# Altium project SoM.PrjPcb (part 4 of 4)
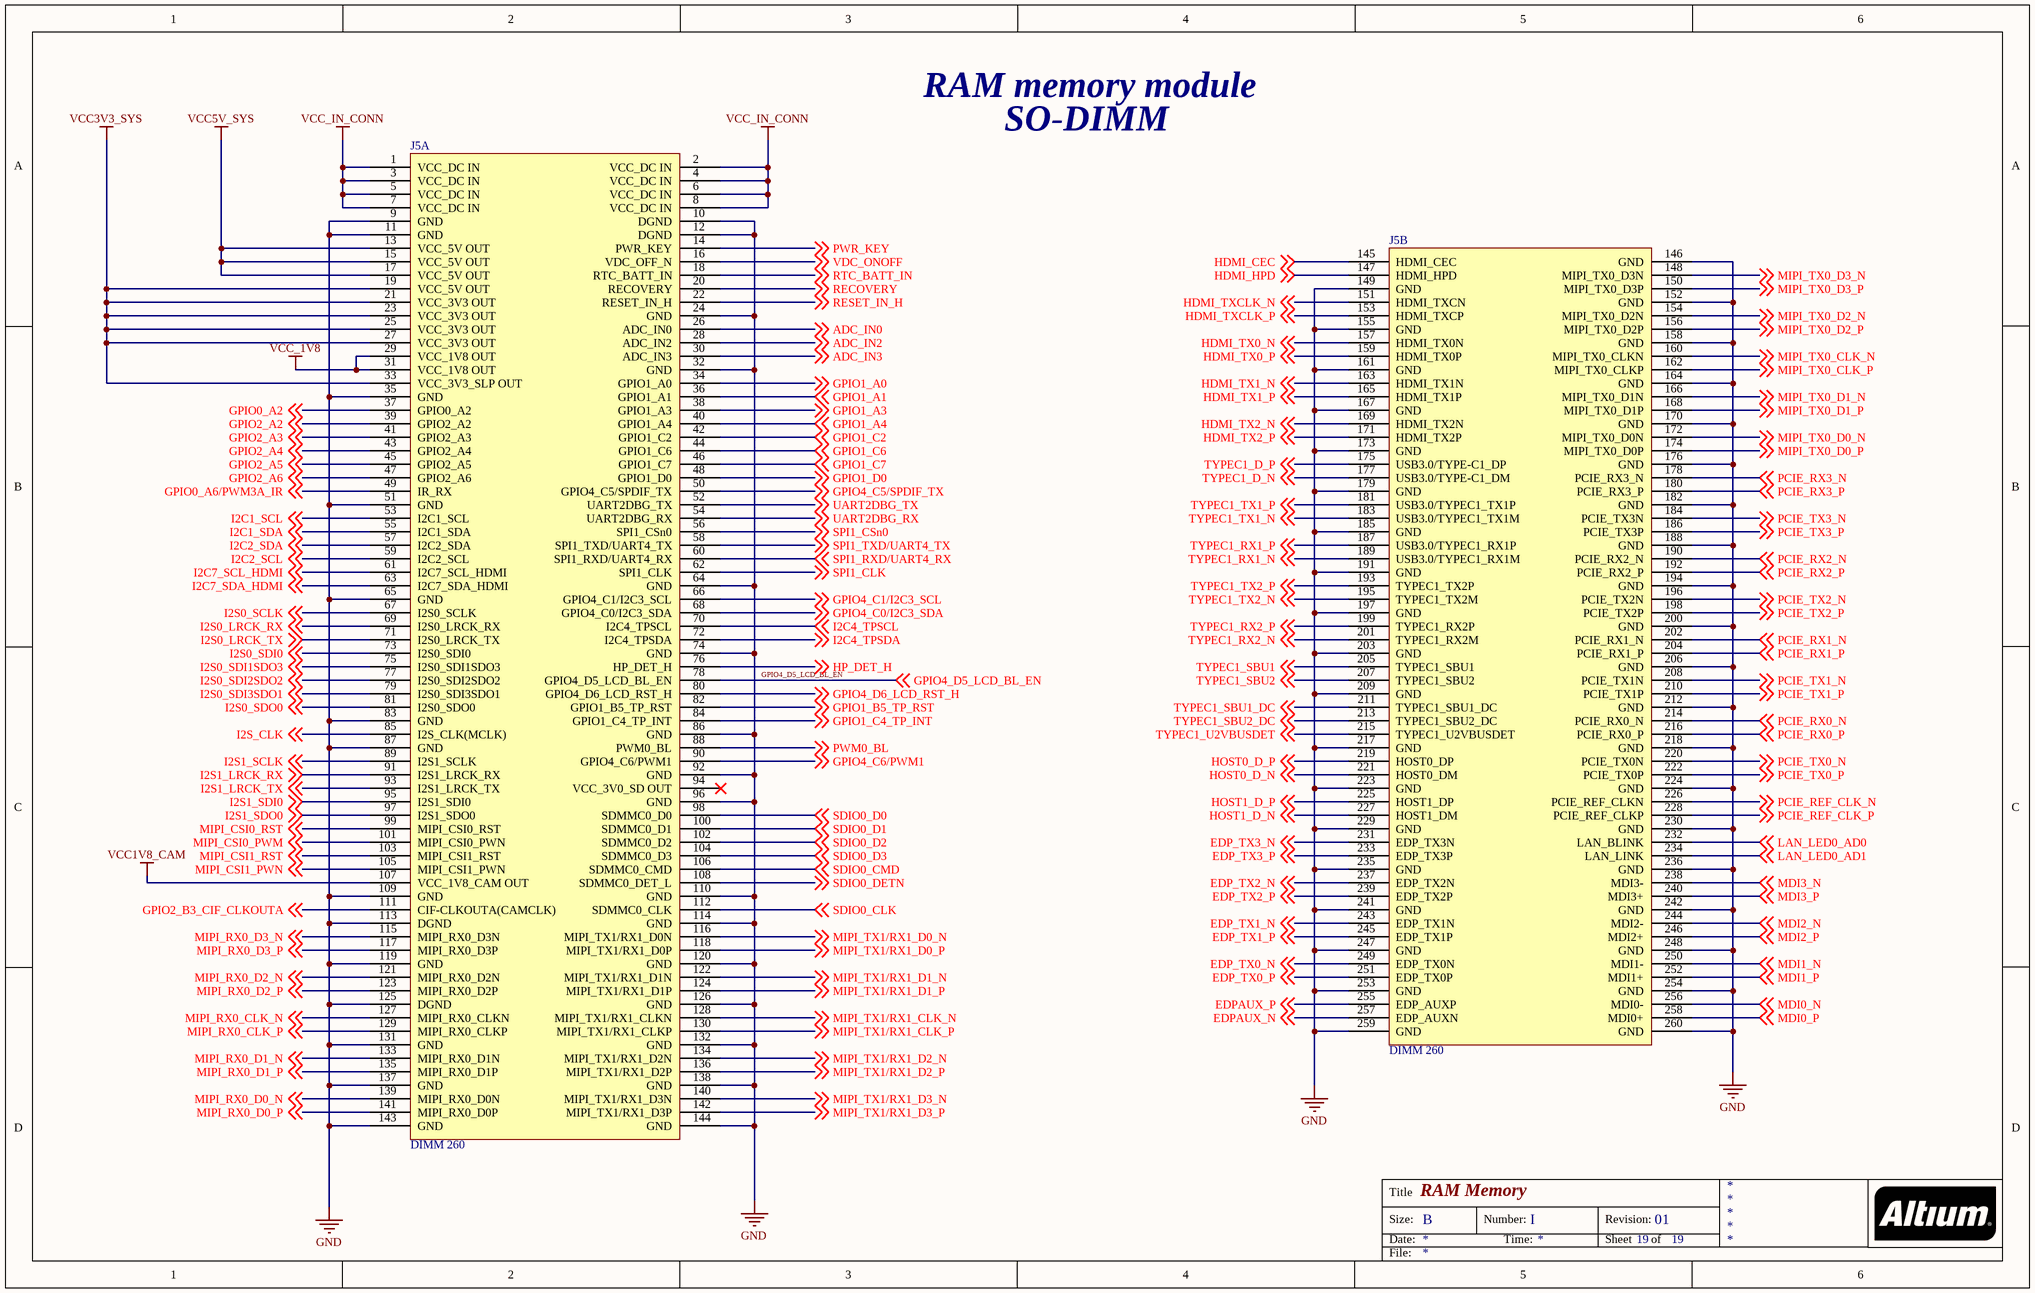
[diagram p19: [19] RAM Memory module.SchDoc]

## Nets that join several sheets
EDP_AVDD_0V9: [2] RK3399_SDRAM (FB3.2 FB5.2), [3] RK3399_PMU (FB8.1 U8.T24), [4] RK3399_EMMC_ADC_PCIE (C187.2 C192.2 U8.L24 U8.W24), [5] RK3399_EDP_CSI_HDMI (6 pins), [6] RK3399_USB2_USIC (8 pins), [17] Voltage_Regulators (C305.2 L7.2 R112.2)
EDP_AVDD_1V8: [11] FlashMemory (9 pins), [3] RK3399_PMU (FB7.2 FB9.1), [4] RK3399_EMMC_ADC_PCIE (5 pins), [5] RK3399_EDP_CSI_HDMI (8 pins), [6] RK3399_USB2_USIC (6 pins), [7] RK3399_MIPI-CSI_I2C (12 pins), [8] RK3399_SDIO_SPI_GPIOs (C225.2 C227.2 U8.AB8 U8.J22), [17] Voltage_Regulators (R105.2 R106.2 R109.1), [18] Power_Management (5 pins), [19] RAM Memory module (J5.29 J5.31)
GND: [9] LPDDR4_SDRAM1 (104 pins), [10] LPDDR_SDRAM2 (104 pins), [11] FlashMemory (19 pins), [12] WIFI_Module (29 pins), [1] RK3399_PowerPins (273 pins), [2] RK3399_SDRAM (20 pins), [3] RK3399_PMU (14 pins), [4] RK3399_EMMC_ADC_PCIE (9 pins), [5] RK3399_EDP_CSI_HDMI (18 pins), [6] RK3399_USB2_USIC (17 pins), [7] RK3399_MIPI-CSI_I2C (6 pins), [8] RK3399_SDIO_SPI_GPIOs (10 pins), [13] TYPEC0_PROG (23 pins), [14] Ethernet (29 pins), [15] PushButtons (Q1.2 SW2.1 SW3.1), [16] SPI_TYPEC_PWR (34 pins), [17] Voltage_Regulators (45 pins), [18] Power_Management (57 pins), [19] RAM Memory module (69 pins)
VCC3V3_S5: [16] SPI_TYPEC_PWR (C281.2 C282.2 C283.2 U14.5), [18] Power_Management (5 pins)
VCC5V_SYS: [12] WIFI_Module (C96.1 U4.1 U4.6), [13] TYPEC0_PROG (5 pins), [15] PushButtons (R92.2), [16] SPI_TYPEC_PWR (8 pins), [19] RAM Memory module (J5.13 J5.15 J5.17)
VCC7: [12] WIFI_Module (5 pins), [3] RK3399_PMU (C185.2 U9.1), [13] TYPEC0_PROG (C234.2 U10.4), [15] PushButtons (SW1.1), [16] SPI_TYPEC_PWR (5 pins), [17] Voltage_Regulators (21 pins), [18] Power_Management (30 pins), [19] RAM Memory module (6 pins)
VCC_DDR: [9] LPDDR4_SDRAM1 (43 pins), [10] LPDDR_SDRAM2 (43 pins), [2] RK3399_SDRAM (44 pins), [18] Power_Management (5 pins)
VCC_DDRC: [9] LPDDR4_SDRAM1 (41 pins), [10] LPDDR_SDRAM2 (41 pins), [18] Power_Management (C347.2 Q5.2)
VCC_IN_CONN: [16] SPI_TYPEC_PWR (10 pins), [18] Power_Management (R129.2), [19] RAM Memory module (8 pins)
VLDO1: [18] Power_Management (C313.2 U19.31), [19] RAM Memory module (J5.107)
VLDO4: [4] RK3399_EMMC_ADC_PCIE (C190.2 U8.T23), [18] Power_Management (C324.2 U19.12)
VLDO6: [8] RK3399_SDIO_SPI_GPIOs (C223.2 C230.2 U8.AC8 U8.N23), [18] Power_Management (C326.2 U19.2)
VLDO7: [8] RK3399_SDIO_SPI_GPIOs (5 pins), [18] Power_Management (C316.2 U19.5)
VLDO8: [8] RK3399_SDIO_SPI_GPIOs (8 pins), [17] Voltage_Regulators (R119.1), [18] Power_Management (C327.2 U19.15)
VSOUT1: [11] FlashMemory (7 pins), [6] RK3399_USB2_USIC (6 pins), [8] RK3399_SDIO_SPI_GPIOs (C226.2 U8.J23), [18] Power_Management (C337.2 U19.7)
ADC_IN0: [4] RK3399_EMMC_ADC_PCIE (U8.AG26), [19] RAM Memory module (J5.26)
ADC_IN2: [4] RK3399_EMMC_ADC_PCIE (U8.AG25), [19] RAM Memory module (J5.28)
ADC_IN3: [4] RK3399_EMMC_ADC_PCIE (U8.AG28), [19] RAM Memory module (J5.30)
CPU_B_SLEEP: [8] RK3399_SDIO_SPI_GPIOs (U8.M27), [17] Voltage_Regulators (U16.A1)
DDR0_A0: [9] LPDDR4_SDRAM1 (U1.H2 U1.R2), [2] RK3399_SDRAM (U8.F2)
DDR0_A1: [9] LPDDR4_SDRAM1 (U1.J2 U1.P2), [2] RK3399_SDRAM (U8.F1)
DDR0_A2: [9] LPDDR4_SDRAM1 (U1.H9 U1.R9), [2] RK3399_SDRAM (U8.G1)
DDR0_A3: [9] LPDDR4_SDRAM1 (U1.H10 U1.R10), [2] RK3399_SDRAM (U8.G2)
DDR0_A4: [9] LPDDR4_SDRAM1 (U1.H11 U1.R11), [2] RK3399_SDRAM (U8.H2)
DDR0_A5: [9] LPDDR4_SDRAM1 (U1.J11 U1.P11), [2] RK3399_SDRAM (U8.H1)
DDR0_CKE0: [9] LPDDR4_SDRAM1 (U1.J4 U1.P4), [2] RK3399_SDRAM (U8.E1)
DDR0_CKE1: [9] LPDDR4_SDRAM1 (U1.J5 U1.P5), [2] RK3399_SDRAM (U8.F5)
DDR0_CLK1_N: [9] LPDDR4_SDRAM1 (U1.P9), [2] RK3399_SDRAM (U8.J5)
DDR0_CLK1_P: [9] LPDDR4_SDRAM1 (U1.P8), [2] RK3399_SDRAM (U8.H5)
DDR0_CLK_N: [9] LPDDR4_SDRAM1 (U1.J9), [2] RK3399_SDRAM (U8.J4)
DDR0_CLK_P: [9] LPDDR4_SDRAM1 (U1.J8), [2] RK3399_SDRAM (U8.H4)
DDR0_CS0N: [9] LPDDR4_SDRAM1 (U1.H4), [2] RK3399_SDRAM (U8.M6)
DDR0_CS1N: [9] LPDDR4_SDRAM1 (U1.H3), [2] RK3399_SDRAM (U8.B1)
DDR0_CS2N: [9] LPDDR4_SDRAM1 (U1.R4), [2] RK3399_SDRAM (U8.M5)
DDR0_CS3N: [9] LPDDR4_SDRAM1 (U1.R3), [2] RK3399_SDRAM (U8.C2)
DDR0_D0: [9] LPDDR4_SDRAM1 (U1.B2), [2] RK3399_SDRAM (U8.AB2)
DDR0_D1: [9] LPDDR4_SDRAM1 (U1.C2), [2] RK3399_SDRAM (U8.AB1)
DDR0_D2: [9] LPDDR4_SDRAM1 (U1.E2), [2] RK3399_SDRAM (U8.AA2)
DDR0_D3: [9] LPDDR4_SDRAM1 (U1.F2), [2] RK3399_SDRAM (U8.AA1)
DDR0_D4: [9] LPDDR4_SDRAM1 (U1.F4), [2] RK3399_SDRAM (U8.Y2)
DDR0_D5: [9] LPDDR4_SDRAM1 (U1.E4), [2] RK3399_SDRAM (U8.Y1)
DDR0_D6: [9] LPDDR4_SDRAM1 (U1.C4), [2] RK3399_SDRAM (U8.W1)
DDR0_D7: [9] LPDDR4_SDRAM1 (U1.B4), [2] RK3399_SDRAM (U8.W2)
DDR0_D8: [9] LPDDR4_SDRAM1 (U1.B11), [2] RK3399_SDRAM (U8.AF2)
DDR0_D9: [9] LPDDR4_SDRAM1 (U1.C11), [2] RK3399_SDRAM (U8.AE2)
DDR0_D10: [9] LPDDR4_SDRAM1 (U1.E11), [2] RK3399_SDRAM (U8.AF1)
DDR0_D11: [9] LPDDR4_SDRAM1 (U1.F11), [2] RK3399_SDRAM (U8.AD2)
DDR0_D12: [9] LPDDR4_SDRAM1 (U1.F9), [2] RK3399_SDRAM (U8.AE1)
DDR0_D13: [9] LPDDR4_SDRAM1 (U1.E9), [2] RK3399_SDRAM (U8.AD1)
DDR0_D14: [9] LPDDR4_SDRAM1 (U1.C9), [2] RK3399_SDRAM (U8.AC1)
DDR0_D15: [9] LPDDR4_SDRAM1 (U1.B9), [2] RK3399_SDRAM (U8.AC2)
DDR0_D16: [9] LPDDR4_SDRAM1 (U1.AA2), [2] RK3399_SDRAM (U8.V1)
DDR0_D17: [9] LPDDR4_SDRAM1 (U1.Y2), [2] RK3399_SDRAM (U8.V2)
DDR0_D18: [9] LPDDR4_SDRAM1 (U1.V2), [2] RK3399_SDRAM (U8.U1)
DDR0_D19: [9] LPDDR4_SDRAM1 (U1.U2), [2] RK3399_SDRAM (U8.U2)
DDR0_D20: [9] LPDDR4_SDRAM1 (U1.U4), [2] RK3399_SDRAM (U8.T1)
DDR0_D21: [9] LPDDR4_SDRAM1 (U1.V4), [2] RK3399_SDRAM (U8.T2)
DDR0_D22: [9] LPDDR4_SDRAM1 (U1.Y4), [2] RK3399_SDRAM (U8.R2)
DDR0_D23: [9] LPDDR4_SDRAM1 (U1.AA4), [2] RK3399_SDRAM (U8.R1)
DDR0_D24: [9] LPDDR4_SDRAM1 (U1.AA11), [2] RK3399_SDRAM (U8.P1)
DDR0_D25: [9] LPDDR4_SDRAM1 (U1.Y11), [2] RK3399_SDRAM (U8.P2)
DDR0_D26: [9] LPDDR4_SDRAM1 (U1.V11), [2] RK3399_SDRAM (U8.N1)
DDR0_D27: [9] LPDDR4_SDRAM1 (U1.U11), [2] RK3399_SDRAM (U8.M1)
DDR0_D28: [9] LPDDR4_SDRAM1 (U1.U9), [2] RK3399_SDRAM (U8.N2)
DDR0_D29: [9] LPDDR4_SDRAM1 (U1.V9), [2] RK3399_SDRAM (U8.L1)
DDR0_D30: [9] LPDDR4_SDRAM1 (U1.Y9), [2] RK3399_SDRAM (U8.M2)
DDR0_D31: [9] LPDDR4_SDRAM1 (U1.AA9), [2] RK3399_SDRAM (U8.L2)
DDR0_DM0: [9] LPDDR4_SDRAM1 (U1.C3), [2] RK3399_SDRAM (U8.Y5)
DDR0_DM1: [9] LPDDR4_SDRAM1 (U1.C10), [2] RK3399_SDRAM (U8.AC5)
DDR0_DM2: [9] LPDDR4_SDRAM1 (U1.Y3), [2] RK3399_SDRAM (U8.U5)
DDR0_DM3: [9] LPDDR4_SDRAM1 (U1.Y10), [2] RK3399_SDRAM (U8.P5)
DDR0_DQS0_N: [9] LPDDR4_SDRAM1 (U1.E3), [2] RK3399_SDRAM (U8.AA4)
DDR0_DQS0_P: [9] LPDDR4_SDRAM1 (U1.D3), [2] RK3399_SDRAM (U8.Y4)
DDR0_DQS1_N: [9] LPDDR4_SDRAM1 (U1.E10), [2] RK3399_SDRAM (U8.AD4)
DDR0_DQS1_P: [9] LPDDR4_SDRAM1 (U1.D10), [2] RK3399_SDRAM (U8.AC4)
DDR0_DQS2_N: [9] LPDDR4_SDRAM1 (U1.V3), [2] RK3399_SDRAM (U8.V4)
DDR0_DQS2_P: [9] LPDDR4_SDRAM1 (U1.W3), [2] RK3399_SDRAM (U8.U4)
DDR0_DQS3_N: [9] LPDDR4_SDRAM1 (U1.V10), [2] RK3399_SDRAM (U8.R4)
DDR0_DQS3_P: [9] LPDDR4_SDRAM1 (U1.W10), [2] RK3399_SDRAM (U8.P4)
DDR0_RST: [9] LPDDR4_SDRAM1 (U1.T11), [2] RK3399_SDRAM (U8.L7)
DDR1_A0: [10] LPDDR_SDRAM2 (U2.H2 U2.R2), [2] RK3399_SDRAM (U8.B10)
DDR1_A1: [10] LPDDR_SDRAM2 (U2.J2 U2.P2), [2] RK3399_SDRAM (U8.A10)
DDR1_A2: [10] LPDDR_SDRAM2 (U2.H9 U2.R9), [2] RK3399_SDRAM (U8.B9)
DDR1_A3: [10] LPDDR_SDRAM2 (U2.H10 U2.R10), [2] RK3399_SDRAM (U8.A9)
DDR1_A4: [10] LPDDR_SDRAM2 (U2.H11 U2.R11), [2] RK3399_SDRAM (U8.B8)
DDR1_A5: [10] LPDDR_SDRAM2 (U2.J11 U2.P11), [2] RK3399_SDRAM (U8.A8)
DDR1_CKE0: [10] LPDDR_SDRAM2 (U2.J4 U2.P4), [2] RK3399_SDRAM (U8.A5)
DDR1_CKE1: [10] LPDDR_SDRAM2 (U2.J5 U2.P5), [2] RK3399_SDRAM (U8.E6)
DDR1_CLK1_N: [10] LPDDR_SDRAM2 (U2.P9), [2] RK3399_SDRAM (U8.E8)
DDR1_CLK1_P: [10] LPDDR_SDRAM2 (U2.P8), [2] RK3399_SDRAM (U8.E9)
DDR1_CLK_N: [10] LPDDR_SDRAM2 (U2.J9), [2] RK3399_SDRAM (U8.D8)
DDR1_CLK_P: [10] LPDDR_SDRAM2 (U2.J8), [2] RK3399_SDRAM (U8.D9)
DDR1_CS0N: [10] LPDDR_SDRAM2 (U2.H4), [2] RK3399_SDRAM (U8.F12)
DDR1_CS1N: [10] LPDDR_SDRAM2 (U2.H3), [2] RK3399_SDRAM (U8.A2)
DDR1_CS2N: [10] LPDDR_SDRAM2 (U2.R4), [2] RK3399_SDRAM (U8.F11)
DDR1_CS3N: [10] LPDDR_SDRAM2 (U2.R3), [2] RK3399_SDRAM (U8.B3)
DDR1_D0: [10] LPDDR_SDRAM2 (U2.B2), [2] RK3399_SDRAM (U8.B15)
DDR1_D1: [10] LPDDR_SDRAM2 (U2.C2), [2] RK3399_SDRAM (U8.A15)
DDR1_D2: [10] LPDDR_SDRAM2 (U2.E2), [2] RK3399_SDRAM (U8.B16)
DDR1_D3: [10] LPDDR_SDRAM2 (U2.F2), [2] RK3399_SDRAM (U8.A16)
DDR1_D4: [10] LPDDR_SDRAM2 (U2.F4), [2] RK3399_SDRAM (U8.B17)
DDR1_D5: [10] LPDDR_SDRAM2 (U2.E4), [2] RK3399_SDRAM (U8.A17)
DDR1_D6: [10] LPDDR_SDRAM2 (U2.C4), [2] RK3399_SDRAM (U8.A18)
DDR1_D7: [10] LPDDR_SDRAM2 (U2.B4), [2] RK3399_SDRAM (U8.B18)
DDR1_D8: [10] LPDDR_SDRAM2 (U2.B11), [2] RK3399_SDRAM (U8.B11)
DDR1_D9: [10] LPDDR_SDRAM2 (U2.C11), [2] RK3399_SDRAM (U8.B12)
DDR1_D10: [10] LPDDR_SDRAM2 (U2.E11), [2] RK3399_SDRAM (U8.A11)
DDR1_D11: [10] LPDDR_SDRAM2 (U2.F11), [2] RK3399_SDRAM (U8.B13)
DDR1_D12: [10] LPDDR_SDRAM2 (U2.F9), [2] RK3399_SDRAM (U8.A12)
DDR1_D13: [10] LPDDR_SDRAM2 (U2.E9), [2] RK3399_SDRAM (U8.A13)
DDR1_D14: [10] LPDDR_SDRAM2 (U2.C9), [2] RK3399_SDRAM (U8.A14)
DDR1_D15: [10] LPDDR_SDRAM2 (U2.B9), [2] RK3399_SDRAM (U8.B14)
DDR1_D16: [10] LPDDR_SDRAM2 (U2.AA2), [2] RK3399_SDRAM (U8.A19)
DDR1_D17: [10] LPDDR_SDRAM2 (U2.Y2), [2] RK3399_SDRAM (U8.B19)
DDR1_D18: [10] LPDDR_SDRAM2 (U2.V2), [2] RK3399_SDRAM (U8.A20)
DDR1_D19: [10] LPDDR_SDRAM2 (U2.U2), [2] RK3399_SDRAM (U8.B20)
DDR1_D20: [10] LPDDR_SDRAM2 (U2.U4), [2] RK3399_SDRAM (U8.A21)
DDR1_D21: [10] LPDDR_SDRAM2 (U2.V4), [2] RK3399_SDRAM (U8.B21)
DDR1_D22: [10] LPDDR_SDRAM2 (U2.Y4), [2] RK3399_SDRAM (U8.B22)
DDR1_D23: [10] LPDDR_SDRAM2 (U2.AA4), [2] RK3399_SDRAM (U8.A22)
DDR1_D24: [10] LPDDR_SDRAM2 (U2.AA11), [2] RK3399_SDRAM (U8.A23)
DDR1_D25: [10] LPDDR_SDRAM2 (U2.Y11), [2] RK3399_SDRAM (U8.B23)
DDR1_D26: [10] LPDDR_SDRAM2 (U2.V11), [2] RK3399_SDRAM (U8.A24)
DDR1_D27: [10] LPDDR_SDRAM2 (U2.U11), [2] RK3399_SDRAM (U8.A25)
DDR1_D28: [10] LPDDR_SDRAM2 (U2.U9), [2] RK3399_SDRAM (U8.B24)
DDR1_D29: [10] LPDDR_SDRAM2 (U2.V9), [2] RK3399_SDRAM (U8.A26)
DDR1_D30: [10] LPDDR_SDRAM2 (U2.Y9), [2] RK3399_SDRAM (U8.B25)
DDR1_D31: [10] LPDDR_SDRAM2 (U2.AA9), [2] RK3399_SDRAM (U8.B26)
DDR1_DM0: [10] LPDDR_SDRAM2 (U2.C3), [2] RK3399_SDRAM (U8.E17)
DDR1_DM1: [10] LPDDR_SDRAM2 (U2.C10), [2] RK3399_SDRAM (U8.E14)
DDR1_DM2: [10] LPDDR_SDRAM2 (U2.Y3), [2] RK3399_SDRAM (U8.E20)
DDR1_DM3: [10] LPDDR_SDRAM2 (U2.Y10), [2] RK3399_SDRAM (U8.E23)
DDR1_DQS0_N: [10] LPDDR_SDRAM2 (U2.E3), [2] RK3399_SDRAM (U8.D17)
DDR1_DQS0_P: [10] LPDDR_SDRAM2 (U2.D3), [2] RK3399_SDRAM (U8.D18)
DDR1_DQS1_N: [10] LPDDR_SDRAM2 (U2.E10), [2] RK3399_SDRAM (U8.D14)
DDR1_DQS1_P: [10] LPDDR_SDRAM2 (U2.D10), [2] RK3399_SDRAM (U8.D15)
DDR1_DQS2_N: [10] LPDDR_SDRAM2 (U2.V3), [2] RK3399_SDRAM (U8.D20)
DDR1_DQS2_P: [10] LPDDR_SDRAM2 (U2.W3), [2] RK3399_SDRAM (U8.D21)
DDR1_DQS3_N: [10] LPDDR_SDRAM2 (U2.V10), [2] RK3399_SDRAM (U8.D23)
DDR1_DQS3_P: [10] LPDDR_SDRAM2 (U2.W10), [2] RK3399_SDRAM (U8.D24)
DDR1_RST: [10] LPDDR_SDRAM2 (U2.T11), [2] RK3399_SDRAM (U8.G11)
EDP_TX0_N: [5] RK3399_EDP_CSI_HDMI (C196.2), [19] RAM Memory module (J5.249)
EDP_TX0_P: [5] RK3399_EDP_CSI_HDMI (C195.2), [19] RAM Memory module (J5.251)
EDP_TX1_N: [5] RK3399_EDP_CSI_HDMI (C198.2), [19] RAM Memory module (J5.243)
EDP_TX1_P: [5] RK3399_EDP_CSI_HDMI (C197.2), [19] RAM Memory module (J5.245)
EDP_TX2_N: [5] RK3399_EDP_CSI_HDMI (C200.2), [19] RAM Memory module (J5.237)
EDP_TX2_P: [5] RK3399_EDP_CSI_HDMI (C199.2), [19] RAM Memory module (J5.239)
EDP_TX3_N: [5] RK3399_EDP_CSI_HDMI (C202.2), [19] RAM Memory module (J5.231)
EDP_TX3_P: [5] RK3399_EDP_CSI_HDMI (C201.2), [19] RAM Memory module (J5.233)
EDPAUX_N: [5] RK3399_EDP_CSI_HDMI (U8.A28), [19] RAM Memory module (J5.257)
EDPAUX_P: [5] RK3399_EDP_CSI_HDMI (U8.B28), [19] RAM Memory module (J5.255)
EFUSE_VQPS_EN_H: [3] RK3399_PMU (U9.3), [8] RK3399_SDIO_SPI_GPIOs (U8.AK3)
EMMC_CLKO: [11] FlashMemory (U3.M5), [4] RK3399_EMMC_ADC_PCIE (R25.2)
EMMC_CMD: [11] FlashMemory (U3.M6), [4] RK3399_EMMC_ADC_PCIE (U8.J31)
EMMC_D0: [11] FlashMemory (U3.A3), [4] RK3399_EMMC_ADC_PCIE (U8.J28)
EMMC_D1: [11] FlashMemory (U3.A4), [4] RK3399_EMMC_ADC_PCIE (U8.J29)
EMMC_D2: [11] FlashMemory (U3.A5), [4] RK3399_EMMC_ADC_PCIE (U8.J30)
EMMC_D3: [11] FlashMemory (U3.B2), [4] RK3399_EMMC_ADC_PCIE (U8.J25)
EMMC_D4: [11] FlashMemory (U3.B3), [4] RK3399_EMMC_ADC_PCIE (U8.J26)
EMMC_D5: [11] FlashMemory (U3.B4), [4] RK3399_EMMC_ADC_PCIE (U8.J27)
EMMC_D6: [11] FlashMemory (U3.B5), [4] RK3399_EMMC_ADC_PCIE (U8.L31)
EMMC_D7: [11] FlashMemory (U3.B6), [4] RK3399_EMMC_ADC_PCIE (U8.K30)
EMMC_STRB: [11] FlashMemory (U3.H5), [4] RK3399_EMMC_ADC_PCIE (U8.K31)
GPIO0_A2: [3] RK3399_PMU (U8.N24), [19] RAM Memory module (J5.37)
GPIO0_A6/PWM3A_IR: [3] RK3399_PMU (U8.P25), [19] RAM Memory module (J5.49)
GPIO0_B5/LED1_OUT: [3] RK3399_PMU (U8.P24), [15] PushButtons (R93.1)
GPIO1_A0: [8] RK3399_SDIO_SPI_GPIOs (U8.R25), [19] RAM Memory module (J5.34)
GPIO1_A1: [8] RK3399_SDIO_SPI_GPIOs (U8.T31), [19] RAM Memory module (J5.36)
GPIO1_A2_CC_INT_L: [8] RK3399_SDIO_SPI_GPIOs (U8.R26), [13] TYPEC0_PROG (U10.5)
GPIO1_A3: [8] RK3399_SDIO_SPI_GPIOs (U8.R27), [19] RAM Memory module (J5.38)
GPIO1_A4: [8] RK3399_SDIO_SPI_GPIOs (U8.R28), [19] RAM Memory module (J5.40)
GPIO1_B5_TP_RST: [8] RK3399_SDIO_SPI_GPIOs (U8.M24), [19] RAM Memory module (J5.82)
GPIO1_C2: [8] RK3399_SDIO_SPI_GPIOs (U8.N31), [19] RAM Memory module (J5.42)
GPIO1_C4_TP_INT: [8] RK3399_SDIO_SPI_GPIOs (U8.M29), [19] RAM Memory module (J5.84)
GPIO1_C6: [8] RK3399_SDIO_SPI_GPIOs (U8.L25), [19] RAM Memory module (J5.44)
GPIO1_C7: [8] RK3399_SDIO_SPI_GPIOs (U8.M31), [19] RAM Memory module (J5.46)
GPIO1_D0: [8] RK3399_SDIO_SPI_GPIOs (U8.L26), [19] RAM Memory module (J5.48)
GPIO2_A2: [7] RK3399_MIPI-CSI_I2C (U8.H30), [19] RAM Memory module (J5.39)
GPIO2_A3: [7] RK3399_MIPI-CSI_I2C (U8.F28), [19] RAM Memory module (J5.41)
GPIO2_A4: [7] RK3399_MIPI-CSI_I2C (U8.H29), [19] RAM Memory module (J5.43)
GPIO2_A5: [7] RK3399_MIPI-CSI_I2C (U8.F29), [19] RAM Memory module (J5.45)
GPIO2_A6: [7] RK3399_MIPI-CSI_I2C (U8.H27), [19] RAM Memory module (J5.47)
GPIO2_B3_CIF_CLKOUTA: [7] RK3399_MIPI-CSI_I2C (U8.H31), [19] RAM Memory module (J5.111)
GPIO4_C0/I2C3_SDA: [8] RK3399_SDIO_SPI_GPIOs (U8.AG6), [19] RAM Memory module (J5.68)
GPIO4_C1/I2C3_SCL: [8] RK3399_SDIO_SPI_GPIOs (U8.AL2), [19] RAM Memory module (J5.66)
GPIO4_C5/SPDIF_TX: [8] RK3399_SDIO_SPI_GPIOs (U8.AK1), [19] RAM Memory module (J5.50)
GPIO4_C6/PWM1: [8] RK3399_SDIO_SPI_GPIOs (U8.AL3), [19] RAM Memory module (J5.90)
GPIO4_D2: [8] RK3399_SDIO_SPI_GPIOs (U8.AH3), [13] TYPEC0_PROG (B1.4)
GPIO4_D5_LCD_BL_EN: [8] RK3399_SDIO_SPI_GPIOs (U8.AJ3), [19] RAM Memory module (J5.78)
GPIO4_D6_LCD_RST_H: [8] RK3399_SDIO_SPI_GPIOs (U8.AG4), [19] RAM Memory module (J5.80)
GPU_SLEEP: [8] RK3399_SDIO_SPI_GPIOs (U8.M25), [17] Voltage_Regulators (U15.A1)
HDMI_CEC: [8] RK3399_SDIO_SPI_GPIOs (U8.AD7), [19] RAM Memory module (J5.145)
HDMI_HPD: [5] RK3399_EDP_CSI_HDMI (D1.K R30.2 U8.AE15), [19] RAM Memory module (J5.147)
HDMI_TX0_N: [5] RK3399_EDP_CSI_HDMI (U8.AL17), [19] RAM Memory module (J5.157)
HDMI_TX0_P: [5] RK3399_EDP_CSI_HDMI (U8.AK17), [19] RAM Memory module (J5.159)
HDMI_TX1_N: [5] RK3399_EDP_CSI_HDMI (U8.AL18), [19] RAM Memory module (J5.163)
HDMI_TX1_P: [5] RK3399_EDP_CSI_HDMI (U8.AK18), [19] RAM Memory module (J5.165)
HDMI_TX2_N: [5] RK3399_EDP_CSI_HDMI (U8.AL19), [19] RAM Memory module (J5.169)
HDMI_TX2_P: [5] RK3399_EDP_CSI_HDMI (U8.AK19), [19] RAM Memory module (J5.171)
HDMI_TXCLK_N: [5] RK3399_EDP_CSI_HDMI (U8.AL16), [19] RAM Memory module (J5.151)
HDMI_TXCLK_P: [5] RK3399_EDP_CSI_HDMI (U8.AK16), [19] RAM Memory module (J5.153)
HOST0_D_N: [6] RK3399_USB2_USIC (U8.AB31), [19] RAM Memory module (J5.221)
HOST0_D_P: [6] RK3399_USB2_USIC (U8.AB30), [19] RAM Memory module (J5.219)
HOST1_D_N: [6] RK3399_USB2_USIC (U8.AA31), [19] RAM Memory module (J5.227)
HOST1_D_P: [6] RK3399_USB2_USIC (U8.AA30), [19] RAM Memory module (J5.225)
HP_DET_H: [8] RK3399_SDIO_SPI_GPIOs (U8.AH5), [19] RAM Memory module (J5.76)
I2C1_SCL: [8] RK3399_SDIO_SPI_GPIOs (R62.1 U8.Y6), [19] RAM Memory module (J5.53)
I2C1_SDA: [8] RK3399_SDIO_SPI_GPIOs (R61.1 U8.AG1), [19] RAM Memory module (J5.55)
I2C2_SCL: [7] RK3399_MIPI-CSI_I2C (R43.1 U8.H25), [19] RAM Memory module (J5.59)
I2C2_SDA: [7] RK3399_MIPI-CSI_I2C (R42.1 U8.G31), [19] RAM Memory module (J5.57)
I2C4_TPSCL: [8] RK3399_SDIO_SPI_GPIOs (R59.1 U8.P30), [13] TYPEC0_PROG (U10.6), [19] RAM Memory module (J5.70)
I2C4_TPSDA: [8] RK3399_SDIO_SPI_GPIOs (R60.1 U8.P31), [13] TYPEC0_PROG (U10.7), [19] RAM Memory module (J5.72)
I2C7_SCL_HDMI: [7] RK3399_MIPI-CSI_I2C (R45.1 U8.H28), [19] RAM Memory module (J5.61)
I2C7_SDA_HDMI: [7] RK3399_MIPI-CSI_I2C (R44.1 U8.G30), [19] RAM Memory module (J5.63)
I2C_SCL_PMIC: [8] RK3399_SDIO_SPI_GPIOs (R57.1 U8.N30), [17] Voltage_Regulators (U15.A3 U16.A3), [18] Power_Management (U19.19)
I2C_SDA_PMIC: [8] RK3399_SDIO_SPI_GPIOs (R58.1 U8.M26), [17] Voltage_Regulators (U15.B1 U16.B1), [18] Power_Management (U19.18)
I2S0_LRCK_RX: [8] RK3399_SDIO_SPI_GPIOs (U8.AF4), [19] RAM Memory module (J5.69)
I2S0_LRCK_TX: [8] RK3399_SDIO_SPI_GPIOs (U8.AJ2), [19] RAM Memory module (J5.71)
I2S0_SCLK: [8] RK3399_SDIO_SPI_GPIOs (U8.AG3), [19] RAM Memory module (J5.67)
I2S0_SDI0: [8] RK3399_SDIO_SPI_GPIOs (U8.Y7), [19] RAM Memory module (J5.73)
I2S0_SDI1SDO3: [8] RK3399_SDIO_SPI_GPIOs (U8.AE5), [19] RAM Memory module (J5.75)
I2S0_SDI2SDO2: [8] RK3399_SDIO_SPI_GPIOs (U8.AA6), [19] RAM Memory module (J5.77)
I2S0_SDI3SDO1: [8] RK3399_SDIO_SPI_GPIOs (U8.AH2), [19] RAM Memory module (J5.79)
I2S0_SDO0: [8] RK3399_SDIO_SPI_GPIOs (U8.AH1), [19] RAM Memory module (J5.81)
I2S1_LRCK_RX: [8] RK3399_SDIO_SPI_GPIOs (U8.AA7), [19] RAM Memory module (J5.91)
I2S1_LRCK_TX: [8] RK3399_SDIO_SPI_GPIOs (U8.AJ1), [19] RAM Memory module (J5.93)
I2S1_SCLK: [8] RK3399_SDIO_SPI_GPIOs (U8.AF3), [19] RAM Memory module (J5.89)
I2S1_SDI0: [8] RK3399_SDIO_SPI_GPIOs (U8.AD6), [19] RAM Memory module (J5.95)
I2S1_SDO0: [8] RK3399_SDIO_SPI_GPIOs (U8.AC6), [19] RAM Memory module (J5.97)
I2S_CLK: [8] RK3399_SDIO_SPI_GPIOs (U8.AC7), [19] RAM Memory module (J5.85)
LAN_LED0_AD0: [14] Ethernet (R80.1 U11.34), [19] RAM Memory module (J5.232)
LAN_LED0_AD1: [14] Ethernet (R83.2 U11.35), [19] RAM Memory module (J5.234)
LOG_DVS_PWM: [8] RK3399_SDIO_SPI_GPIOs (U8.M28), [17] Voltage_Regulators (R117.1 R119.2)
MAC_COL: [8] RK3399_SDIO_SPI_GPIOs (U8.D27), [14] Ethernet (R84.1 U11.33)
MAC_CRS: [8] RK3399_SDIO_SPI_GPIOs (U8.B27), [14] Ethernet (C255.2 R73.1 U11.29)
MAC_MCLK: [8] RK3399_SDIO_SPI_GPIOs (R54.2), [14] Ethernet (R74.1)
MAC_MDC: [8] RK3399_SDIO_SPI_GPIOs (U8.E29), [14] Ethernet (U11.30)
MAC_MDIO: [8] RK3399_SDIO_SPI_GPIOs (U8.G26), [14] Ethernet (R71.1 U11.31)
MAC_RXCLK: [8] RK3399_SDIO_SPI_GPIOs (U8.F25), [14] Ethernet (R76.1)
MAC_RXD0: [8] RK3399_SDIO_SPI_GPIOs (U8.E26), [14] Ethernet (R88.1 U11.14)
MAC_RXD1: [8] RK3399_SDIO_SPI_GPIOs (U8.F27), [14] Ethernet (R81.2 R82.1 U11.16)
MAC_RXD2: [8] RK3399_SDIO_SPI_GPIOs (U8.E30), [14] Ethernet (R89.1 U11.17)
MAC_RXD3: [8] RK3399_SDIO_SPI_GPIOs (U8.E25), [14] Ethernet (R91.1 U11.18)
MAC_RXDV: [8] RK3399_SDIO_SPI_GPIOs (U8.C27), [14] Ethernet (R87.2 U11.13)
MAC_RXER: [8] RK3399_SDIO_SPI_GPIOs (U8.F23), [14] Ethernet (R72.1 U11.20)
MAC_TXCLK: [8] RK3399_SDIO_SPI_GPIOs (R56.2), [14] Ethernet (R79.1)
MAC_TXD0: [8] RK3399_SDIO_SPI_GPIOs (R50.2), [14] Ethernet (U11.23)
MAC_TXD1: [8] RK3399_SDIO_SPI_GPIOs (R51.1), [14] Ethernet (U11.24)
MAC_TXD2: [8] RK3399_SDIO_SPI_GPIOs (R46.2), [14] Ethernet (U11.25)
MAC_TXD3: [8] RK3399_SDIO_SPI_GPIOs (R49.1), [14] Ethernet (U11.26)
MAC_TXEN: [8] RK3399_SDIO_SPI_GPIOs (R55.1), [14] Ethernet (U11.27)
MDI0_N: [14] Ethernet (U11.2), [19] RAM Memory module (J5.256)
MDI0_P: [14] Ethernet (U11.1), [19] RAM Memory module (J5.258)
MDI1_N: [14] Ethernet (U11.5), [19] RAM Memory module (J5.250)
MDI1_P: [14] Ethernet (U11.4), [19] RAM Memory module (J5.252)
MDI2_N: [14] Ethernet (U11.8), [19] RAM Memory module (J5.244)
MDI2_P: [14] Ethernet (U11.7), [19] RAM Memory module (J5.246)
MDI3_N: [14] Ethernet (U11.11), [19] RAM Memory module (J5.238)
MDI3_P: [14] Ethernet (U11.10), [19] RAM Memory module (J5.240)
MIPI_CSI0_PWM: [8] RK3399_SDIO_SPI_GPIOs (U8.AF8), [19] RAM Memory module (J5.101)
MIPI_CSI0_RST: [8] RK3399_SDIO_SPI_GPIOs (U8.AD9), [19] RAM Memory module (J5.99)
MIPI_CSI1_PWN: [3] RK3399_PMU (U8.V26), [19] RAM Memory module (J5.105)
MIPI_CSI1_RST: [3] RK3399_PMU (U8.U28), [19] RAM Memory module (J5.103)
MIPI_RX0_CLK_N: [7] RK3399_MIPI-CSI_I2C (U8.AL13), [19] RAM Memory module (J5.127)
MIPI_RX0_CLK_P: [7] RK3399_MIPI-CSI_I2C (U8.AK13), [19] RAM Memory module (J5.129)
MIPI_RX0_D0_N: [7] RK3399_MIPI-CSI_I2C (U8.AL15), [19] RAM Memory module (J5.139)
MIPI_RX0_D0_P: [7] RK3399_MIPI-CSI_I2C (U8.AK15), [19] RAM Memory module (J5.141)
MIPI_RX0_D1_N: [7] RK3399_MIPI-CSI_I2C (U8.AL14), [19] RAM Memory module (J5.133)
MIPI_RX0_D1_P: [7] RK3399_MIPI-CSI_I2C (U8.AK14), [19] RAM Memory module (J5.135)
MIPI_RX0_D2_N: [7] RK3399_MIPI-CSI_I2C (U8.AL12), [19] RAM Memory module (J5.121)
MIPI_RX0_D2_P: [7] RK3399_MIPI-CSI_I2C (U8.AK12), [19] RAM Memory module (J5.123)
MIPI_RX0_D3_N: [7] RK3399_MIPI-CSI_I2C (U8.AL11), [19] RAM Memory module (J5.115)
MIPI_RX0_D3_P: [7] RK3399_MIPI-CSI_I2C (U8.AK11), [19] RAM Memory module (J5.117)
MIPI_TX0_CLK_N: [5] RK3399_EDP_CSI_HDMI (U8.AH12), [19] RAM Memory module (J5.160)
MIPI_TX0_CLK_P: [5] RK3399_EDP_CSI_HDMI (U8.AG12), [19] RAM Memory module (J5.162)
MIPI_TX0_D0_N: [5] RK3399_EDP_CSI_HDMI (U8.AH15), [19] RAM Memory module (J5.172)
MIPI_TX0_D0_P: [5] RK3399_EDP_CSI_HDMI (U8.AG15), [19] RAM Memory module (J5.174)
MIPI_TX0_D1_N: [5] RK3399_EDP_CSI_HDMI (U8.AH14), [19] RAM Memory module (J5.166)
MIPI_TX0_D1_P: [5] RK3399_EDP_CSI_HDMI (U8.AG14), [19] RAM Memory module (J5.168)
MIPI_TX0_D2_N: [5] RK3399_EDP_CSI_HDMI (U8.AH11), [19] RAM Memory module (J5.154)
MIPI_TX0_D2_P: [5] RK3399_EDP_CSI_HDMI (U8.AG11), [19] RAM Memory module (J5.156)
MIPI_TX0_D3_N: [5] RK3399_EDP_CSI_HDMI (U8.AH9), [19] RAM Memory module (J5.148)
MIPI_TX0_D3_P: [5] RK3399_EDP_CSI_HDMI (U8.AG9), [19] RAM Memory module (J5.150)
MIPI_TX1/RX1_CLK_N: [7] RK3399_MIPI-CSI_I2C (U8.AL8), [19] RAM Memory module (J5.128)
MIPI_TX1/RX1_CLK_P: [7] RK3399_MIPI-CSI_I2C (U8.AK8), [19] RAM Memory module (J5.130)
MIPI_TX1/RX1_D0_N: [7] RK3399_MIPI-CSI_I2C (U8.AL6), [19] RAM Memory module (J5.116)
MIPI_TX1/RX1_D0_P: [7] RK3399_MIPI-CSI_I2C (U8.AK6), [19] RAM Memory module (J5.118)
MIPI_TX1/RX1_D1_N: [7] RK3399_MIPI-CSI_I2C (U8.AL7), [19] RAM Memory module (J5.122)
MIPI_TX1/RX1_D1_P: [7] RK3399_MIPI-CSI_I2C (U8.AK7), [19] RAM Memory module (J5.124)
MIPI_TX1/RX1_D2_N: [7] RK3399_MIPI-CSI_I2C (U8.AL9), [19] RAM Memory module (J5.134)
MIPI_TX1/RX1_D2_P: [7] RK3399_MIPI-CSI_I2C (U8.AK9), [19] RAM Memory module (J5.136)
MIPI_TX1/RX1_D3_N: [7] RK3399_MIPI-CSI_I2C (U8.AL10), [19] RAM Memory module (J5.140)
MIPI_TX1/RX1_D3_P: [7] RK3399_MIPI-CSI_I2C (U8.AK10), [19] RAM Memory module (J5.142)
OTP_OUT_H: [8] RK3399_SDIO_SPI_GPIOs (U8.P26), [17] Voltage_Regulators (R113.1)
PCIE_REF_CLK_N: [4] RK3399_EMMC_ADC_PCIE (U8.AD30), [19] RAM Memory module (J5.226)
PCIE_REF_CLK_P: [4] RK3399_EMMC_ADC_PCIE (U8.AD31), [19] RAM Memory module (J5.228)
PCIE_RX0_N: [4] RK3399_EMMC_ADC_PCIE (U8.AF31), [19] RAM Memory module (J5.214)
PCIE_RX0_P: [4] RK3399_EMMC_ADC_PCIE (U8.AF30), [19] RAM Memory module (J5.216)
PCIE_RX1_N: [4] RK3399_EMMC_ADC_PCIE (U8.AH31), [19] RAM Memory module (J5.202)
PCIE_RX1_P: [4] RK3399_EMMC_ADC_PCIE (U8.AH30), [19] RAM Memory module (J5.204)
PCIE_RX2_N: [4] RK3399_EMMC_ADC_PCIE (U8.AC28), [19] RAM Memory module (J5.190)
PCIE_RX2_P: [4] RK3399_EMMC_ADC_PCIE (U8.AC27), [19] RAM Memory module (J5.192)
PCIE_RX3_N: [4] RK3399_EMMC_ADC_PCIE (U8.AF28), [19] RAM Memory module (J5.178)
PCIE_RX3_P: [4] RK3399_EMMC_ADC_PCIE (U8.AF27), [19] RAM Memory module (J5.180)
PCIE_TX0_N: [4] RK3399_EMMC_ADC_PCIE (U8.AE31), [19] RAM Memory module (J5.220)
PCIE_TX0_P: [4] RK3399_EMMC_ADC_PCIE (U8.AE30), [19] RAM Memory module (J5.222)
PCIE_TX1_N: [4] RK3399_EMMC_ADC_PCIE (U8.AG31), [19] RAM Memory module (J5.208)
PCIE_TX1_P: [4] RK3399_EMMC_ADC_PCIE (U8.AG30), [19] RAM Memory module (J5.210)
PCIE_TX2_N: [4] RK3399_EMMC_ADC_PCIE (U8.AA28), [19] RAM Memory module (J5.196)
PCIE_TX2_P: [4] RK3399_EMMC_ADC_PCIE (U8.AA27), [19] RAM Memory module (J5.198)
PCIE_TX3_N: [4] RK3399_EMMC_ADC_PCIE (U8.AD28), [19] RAM Memory module (J5.184)
PCIE_TX3_P: [4] RK3399_EMMC_ADC_PCIE (U8.AD27), [19] RAM Memory module (J5.186)
PMIC_EXT_EN: [16] SPI_TYPEC_PWR (R100.1 U12.8), [17] Voltage_Regulators (U18.2), [18] Power_Management (U19.55)
PMIC_INT_L: [8] RK3399_SDIO_SPI_GPIOs (U8.M30), [18] Power_Management (C344.2 U19.49)
PMIC_SLEEP_H: [8] RK3399_SDIO_SPI_GPIOs (U8.R30), [18] Power_Management (C345.2 Q6.1 U19.50)
PWM0_BL: [8] RK3399_SDIO_SPI_GPIOs (U8.AF5), [19] RAM Memory module (J5.88)
PWR_KEY: [15] PushButtons (SW3.2), [18] Power_Management (R128.1), [19] RAM Memory module (J5.14)
PWR_KEY_L: [3] RK3399_PMU (U8.V27), [18] Power_Management (D6.A)
RECOVERY: [4] RK3399_EMMC_ADC_PCIE (R27.2), [15] PushButtons (SW2.2), [19] RAM Memory module (J5.20)
RESET_IN_H: [15] PushButtons (SW1.2), [17] Voltage_Regulators (Q3.3), [18] Power_Management (C346.2 U19.6), [19] RAM Memory module (J5.22)
RespWROM: [3] RK3399_PMU (R22.1), [18] Power_Management (R124.1 U19.20)
RTC_BATT_IN: [18] Power_Management (D5.A1), [19] RAM Memory module (J5.18)
RTC_CLKO_SOC: [3] RK3399_PMU (U8.U31), [18] Power_Management (R126.1 U19.68)
SDIO0_CLK: [8] RK3399_SDIO_SPI_GPIOs (U8.AF7), [19] RAM Memory module (J5.112)
SDIO0_CMD: [8] RK3399_SDIO_SPI_GPIOs (U8.AH6), [19] RAM Memory module (J5.106)
SDIO0_D0: [8] RK3399_SDIO_SPI_GPIOs (U8.AD8), [19] RAM Memory module (J5.98)
SDIO0_D1: [8] RK3399_SDIO_SPI_GPIOs (U8.AK5), [19] RAM Memory module (J5.100)
SDIO0_D2: [8] RK3399_SDIO_SPI_GPIOs (U8.AG7), [19] RAM Memory module (J5.102)
SDIO0_D3: [8] RK3399_SDIO_SPI_GPIOs (U8.AE8), [19] RAM Memory module (J5.104)
SDIO0_DETN: [8] RK3399_SDIO_SPI_GPIOs (U8.AL4), [19] RAM Memory module (J5.108)
SDMMC0_CLK: [12] WIFI_Module (U6.E1), [4] RK3399_EMMC_ADC_PCIE (R24.2)
SDMMC0_CMD: [12] WIFI_Module (U6.A2), [4] RK3399_EMMC_ADC_PCIE (U8.V25)
SDMMC0_D0: [12] WIFI_Module (U6.A1), [4] RK3399_EMMC_ADC_PCIE (U8.Y27)
SDMMC0_D1: [12] WIFI_Module (U6.B2), [4] RK3399_EMMC_ADC_PCIE (U8.Y26)
SDMMC0_D2: [12] WIFI_Module (U6.B1), [4] RK3399_EMMC_ADC_PCIE (U8.Y28)
SDMMC0_D3: [12] WIFI_Module (U6.C2), [4] RK3399_EMMC_ADC_PCIE (U8.U27)
SDMMC0_DET_L: [12] WIFI_Module (R18.1), [3] RK3399_PMU (U8.V28)
SPI1_CLK: [8] RK3399_SDIO_SPI_GPIOs (U8.P28), [19] RAM Memory module (J5.62)
SPI1_CSn0: [8] RK3399_SDIO_SPI_GPIOs (U8.P29), [19] RAM Memory module (J5.56)
SPI1_RXD/UART4_RX: [8] RK3399_SDIO_SPI_GPIOs (U8.P27), [19] RAM Memory module (J5.60)
SPI1_TXD/UART4_TX: [8] RK3399_SDIO_SPI_GPIOs (U8.R31), [19] RAM Memory module (J5.58)
TYPEC0_D_N: [6] RK3399_USB2_USIC (U8.AH23), [13] TYPEC0_PROG (J3.A7 J3.B7)
TYPEC0_D_P: [6] RK3399_USB2_USIC (U8.AG23), [13] TYPEC0_PROG (J3.A6 J3.B6)
TYPEC0_RX1_N: [6] RK3399_USB2_USIC (U8.AL21), [13] TYPEC0_PROG (J3.B10)
TYPEC0_RX1_P: [6] RK3399_USB2_USIC (U8.AK21), [13] TYPEC0_PROG (J3.B11)
TYPEC0_RX2_N: [6] RK3399_USB2_USIC (U8.AL23), [13] TYPEC0_PROG (J3.A10)
TYPEC0_RX2_P: [6] RK3399_USB2_USIC (U8.AK23), [13] TYPEC0_PROG (J3.A11)
TYPEC0_SBU1_DC_N: [6] RK3399_USB2_USIC (U8.AG17), [13] TYPEC0_PROG (R67.1)
TYPEC0_SBU1_DC_P: [6] RK3399_USB2_USIC (U8.AH17), [13] TYPEC0_PROG (R68.1)
TYPEC0_SBU1_N: [6] RK3399_USB2_USIC (U8.AL20), [13] TYPEC0_PROG (C244.1)
TYPEC0_SBU1_P: [6] RK3399_USB2_USIC (U8.AK20), [13] TYPEC0_PROG (C242.1)
TYPEC0_TX1_N: [6] RK3399_USB2_USIC (U8.AK22), [13] TYPEC0_PROG (C237.1)
TYPEC0_TX1_P: [6] RK3399_USB2_USIC (U8.AL22), [13] TYPEC0_PROG (C238.1)
TYPEC0_TX2_N: [6] RK3399_USB2_USIC (U8.AK24), [13] TYPEC0_PROG (C239.1)
TYPEC0_TX2_P: [6] RK3399_USB2_USIC (U8.AL24), [13] TYPEC0_PROG (C240.1)
TYPEC0_U2VBUSDET: [6] RK3399_USB2_USIC (R36.2), [13] TYPEC0_PROG (D4.K R63.1)
TYPEC1_D_N: [6] RK3399_USB2_USIC (U8.AH24), [19] RAM Memory module (J5.177)
TYPEC1_D_P: [6] RK3399_USB2_USIC (U8.AG24), [19] RAM Memory module (J5.175)
TYPEC1_RX1_N: [6] RK3399_USB2_USIC (U8.AL25), [19] RAM Memory module (J5.189)
TYPEC1_RX1_P: [6] RK3399_USB2_USIC (U8.AK25), [19] RAM Memory module (J5.187)
TYPEC1_RX2_N: [6] RK3399_USB2_USIC (U8.AL27), [19] RAM Memory module (J5.201)
TYPEC1_RX2_P: [6] RK3399_USB2_USIC (U8.AK27), [19] RAM Memory module (J5.199)
TYPEC1_SBU1: [6] RK3399_USB2_USIC (U8.AK29), [19] RAM Memory module (J5.205)
TYPEC1_SBU1_DC: [6] RK3399_USB2_USIC (U8.AE24), [19] RAM Memory module (J5.211)
TYPEC1_SBU2: [6] RK3399_USB2_USIC (U8.AL29), [19] RAM Memory module (J5.207)
TYPEC1_SBU2_DC: [6] RK3399_USB2_USIC (U8.AF25), [19] RAM Memory module (J5.213)
TYPEC1_TX1_N: [6] RK3399_USB2_USIC (U8.AK26), [19] RAM Memory module (J5.183)
TYPEC1_TX1_P: [6] RK3399_USB2_USIC (U8.AL26), [19] RAM Memory module (J5.181)
TYPEC1_TX2_N: [6] RK3399_USB2_USIC (U8.AK28), [19] RAM Memory module (J5.195)
TYPEC1_TX2_P: [6] RK3399_USB2_USIC (U8.AL28), [19] RAM Memory module (J5.193)
TYPEC1_U2VBUSDET: [6] RK3399_USB2_USIC (R38.2), [19] RAM Memory module (J5.215)
UART2DBG_RX: [8] RK3399_SDIO_SPI_GPIOs (U8.AK2), [19] RAM Memory module (J5.54)
UART2DBG_TX: [8] RK3399_SDIO_SPI_GPIOs (U8.AJ4), [19] RAM Memory module (J5.52)
VDC_ONOFF: [18] Power_Management (R127.2), [19] RAM Memory module (J5.16)
VDD_CPU_B_FB: [1] RK3399_PowerPins (U8.N18), [17] Voltage_Regulators (R108.1 U16.A4)
VDD_GPU_FB: [1] RK3399_PowerPins (U8.T15), [17] Voltage_Regulators (R107.1 U15.A4)